# Altium schematic sheet main.SchDoc
size A4
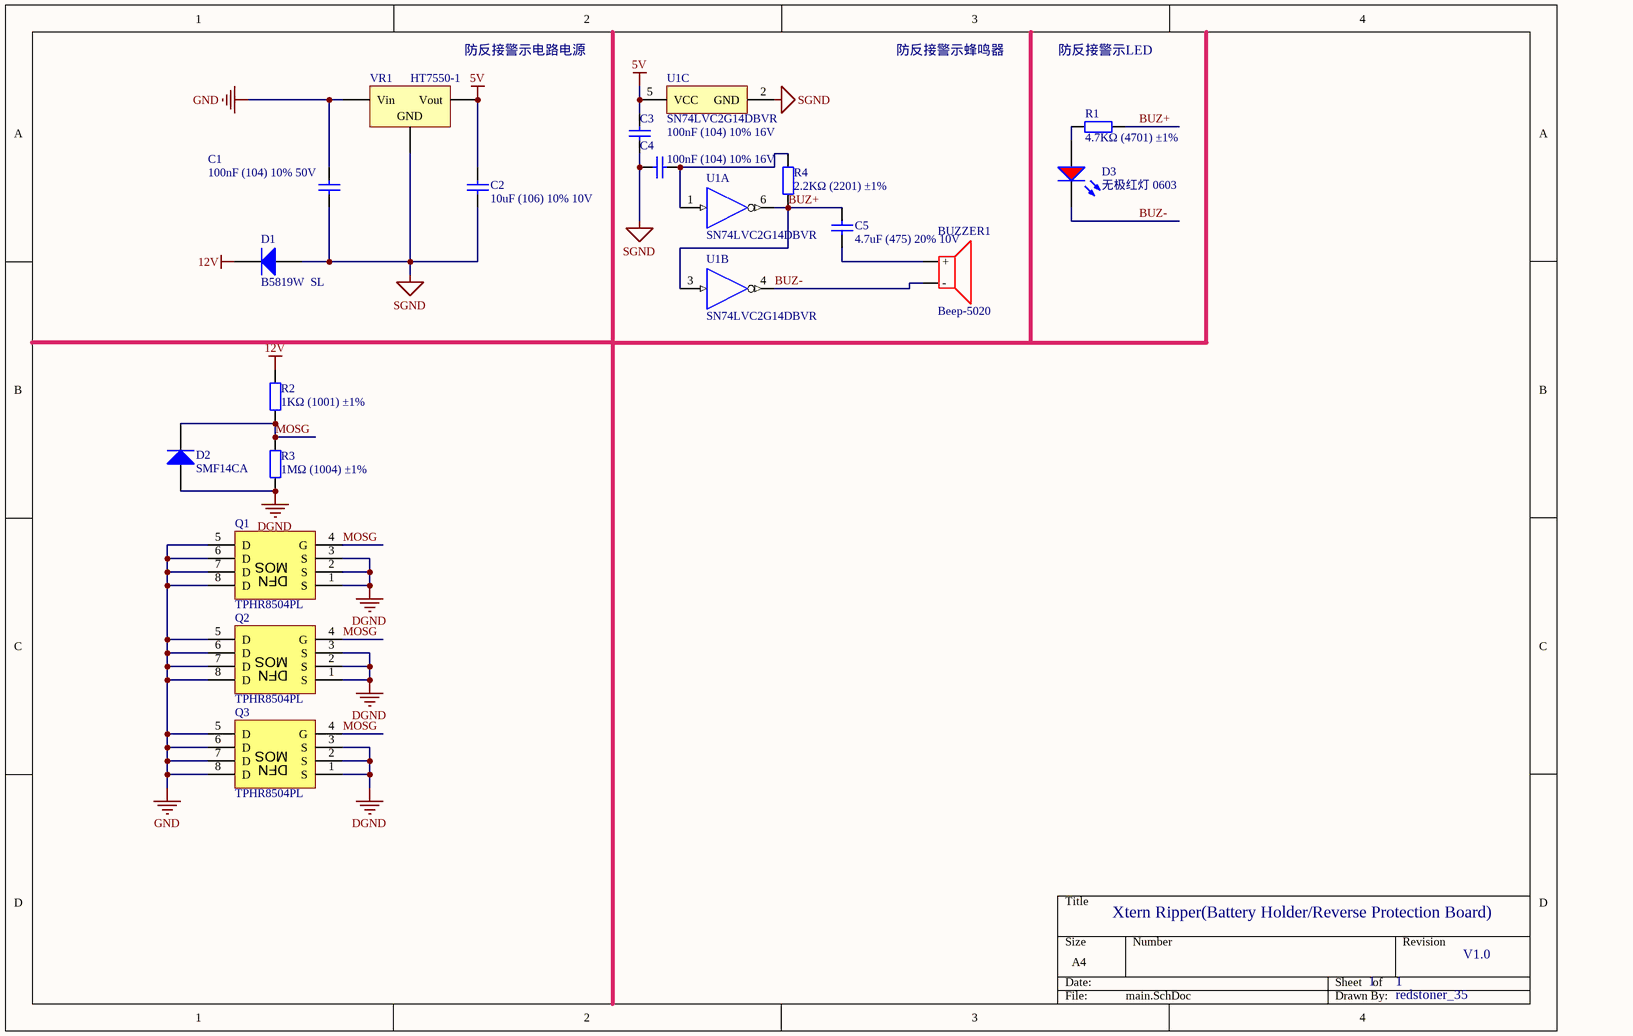
[diagram p0: main.SchDoc]

## Parts
BUZZER1  Beep-5020  [5020BUZZER]
C1  100nF (104) 10% 50V  [0603_C]
C2  10uF (106) 10% 10V  [0603_C]
C3  100nF (104) 10% 16V  [0402_C]
C4  100nF (104) 10% 16V  [0402_C]
C5  4.7uF (475) 20% 10V  [0402_C]
D1  B5819W  SL  [SOD-123]
D2  SMF14CA  [SOD-123]
D3  无极红灯 0603  [0603_LED_S1]
Q1  TPHR8504PL  [SON/DFN5x6(MOS)]
Q2  TPHR8504PL  [SON/DFN5x6(MOS)]
Q3  TPHR8504PL  [SON/DFN5x6(MOS)]
R1  4.7KΩ (4701) ±1%  [0402_R]
R2  1KΩ (1001) ±1%  [0805_R]
R3  1MΩ (1004) ±1%  [0402_R]
R4  2.2KΩ (2201) ±1%  [0402_R]
U1  SN74LVC2G14DBVR  [DBV0006A_N]  (parts A,B,C of 3)
VR1  HT7550-1  [SOT-89(SOT-89-3)]

## Nets
5V: C2.2 C3.2 U1.5(VCC) VR1.3(Vout)
12V: D1.2(K) R2.2
DGND: D2.1(A) Q1.1(S) Q1.2(S) Q1.3(S) Q2.1(S) Q2.2(S) Q2.3(S) Q3.1(S) Q3.2(S) Q3.3(S) R3.1
GND: C1.2 Q1.5(D) Q1.6(D) Q1.7(D) Q1.8(D) Q2.5(D) Q2.6(D) Q2.7(D) Q2.8(D) Q3.5(D) Q3.6(D) Q3.7(D) Q3.8(D) VR1.2(Vin)
SGND: C1.1 C2.1 C3.1 C4.2 D1.1(A) U1.2(GND) VR1.1(GND)
BUZ+: C5.2 R1.2 R4.1 U1.3(2A) U1.6(1Y)
BUZ-: BUZZER1.2(-) D3.K U1.4(2Y)
MOSG: D2.2(K) Q1.4(G) Q2.4(G) Q3.4(G) R2.1 R3.2
NetBUZZER1_1: BUZZER1.1(+) C5.1
NetC4_1: C4.1 R4.2 U1.1(1A)
NetD3_A: D3.A R1.1

## Notes on the sheet
- (near VR1) 防反接警示电路电源
- 防反接警示蜂鸣器
- 防反接警示LED
- Xtern Ripper(Battery Holder/Reverse Protection Board)
- 1
- V1.0
- redstoner_35
- (in symbol SON/DFN5x6 MOS) MOS; DFN

## Library data of the parts
BUZZER1 = Beep-5020: 贴片蜂鸣器5020最小封装
C1 = 0603 100nF (104) 10% 50V: 贴片电容; ComponentLink1Description: 供应商链接; ComponentLink1URL: http://www.szlcsc.com/product/details_15331.html; Package: 0603; Supplier: LC; SuppliersPartNumber: C14663
C2 = 0603 10uF (106) 10% 10V: 贴片电容; ComponentLink1Description: 供应商链接; ComponentLink1URL: http://www.szlcsc.com/product/details_20411.html; Package: 0603; Supplier: LC; SuppliersPartNumber: C19702
C3 C4 = 0402 100nF (104) 10% 16V: 贴片电容; ComponentLink1Description: 供应商链接; ComponentLink1URL: http://www.szlcsc.com/product/details_1877.html; Package: 0402; Supplier: LC; SuppliersPartNumber: C1525
C5 = 0402 4.7uF (475) 20% 10V: 贴片电容; ComponentLink1Description: 供应商链接; ComponentLink1URL: http://www.szlcsc.com/product/details_24469.html; Package: 0402; Supplier: LC; SuppliersPartNumber: C23733
D1 = SOD-123 B5819W  SL: 肖特基二极管; ComponentLink1Description: 供应商链接; ComponentLink1URL: http://www.szlcsc.com/product/details_9093.html; Package: SOD-123; Supplier: LC; SuppliersPartNumber: C8598
D2 = SOD-123 B5819W  SL: TVS二极管; ComponentLink1Description: 供应商链接; ComponentLink1URL: http://www.szlcsc.com/product/details_9093.html; Package: SOD-123; Supplier: LC; SuppliersPartNumber: C8598
D3 = 0603 红灯: 发光二极管; ComponentLink1Description: 供应商链接; ComponentLink1URL: http://www.szlcsc.com/product/details_2659.html; Package: 0603; Supplier: LC; SuppliersPartNumber: C2286
Q1-Q3 = SON/DFN5x6 MOS: N channel MOSFET 0.7mR 150A 40V
R1 = 0402 4.7KΩ (4701) 1%: 贴片电阻; ComponentLink1Description: 供应商链接; ComponentLink1URL: http://www.szlcsc.com/product/details_26643.html; Package: 0402; Supplier: LC; SuppliersPartNumber: C25900
R2 = 0805 1KΩ (1001) 1%: 贴片电阻; ComponentLink1Description: 供应商链接; ComponentLink1URL: http://www.szlcsc.com/product/details_18201.html; Package: 0805; Supplier: LC; SuppliersPartNumber: C17513
R3 = 0402 1MΩ (1004) 1%: 贴片电阻; ComponentLink1Description: 供应商链接; ComponentLink1URL: http://www.szlcsc.com/product/details_26826.html; Package: 0402; Supplier: LC; SuppliersPartNumber: C26083
R4 = 0402 2.2KΩ (2201) 1%: 贴片电阻; ComponentLink1Description: 供应商链接; ComponentLink1URL: http://www.szlcsc.com/product/details_26622.html; Package: 0402; Supplier: LC; SuppliersPartNumber: C25879
U1 = SN74LVC2G14DBVR: Dual Schmitt-Trigger Inverter, DBV0006A, LARGE T&R; Manufacturer: Texas Instruments; VCC(Min)(V): 1.65; VCC(Max)(V): 5.5; Output Type: CMOS; ICC @ Nom Voltage(Max)(mA): 0.01; Input Type: CMOS/TTL; Bits(#): 2; F @ Nom Voltage(Max)(Mhz): 150; Rating: Catalog; Technology Family: LVC; Voltage(Nom)(V): 1.8,2.5,3.3,5; Schmitt Trigger: Yes; Output Drive (IOL/IOH)(Max)(mA): 32/-32; tpd @ Nom Voltage(Max)(ns): 9.5,5.7,5.4,4.3; Logic: Inverting; Sub-Family: Inverting Buffer/Driver; 3-State Output: No; DatasheetVersion: SCES200M; PackageReference: DBV0006A; Supplier 1: Mouser; Supplier Part Number 1: 595-SN74LVC2G14DBVR; Supplier 2: Digi-Key; Supplier Part Number 2: 296-13010-2-ND; Supplier 3: Digi-Key; Supplier Part Number 3: 296-13010-1-ND; Supplier 4: Digi-Key; Supplier Part Number 4: 296-13010-6-ND; Generic Part Number: SN74LVC2G14; Operating Temperature Range(C): -40 to 125; PartNumber: SN74LVC2G14DBVR; ComponentLink1Description: Manufacturer URL; ComponentLink1URL: http://www.ti.com/; ComponentLink2Description: Datasheet; ComponentLink2URL: http://www.ti.com/lit/ds/symlink/sn74lvc2g14.pdf
VR1 = SOT-89 HT7550-1: 低压差线性稳压(LDO); ComponentLink1Description: 供应商链接; ComponentLink1URL: http://www.szlcsc.com/product/details_16788.html; Package: SOT-89; Supplier: LC; SuppliersPartNumber: C16106